# EAGLE schematic Esquemático v92 (EAGLE 9.7.0)
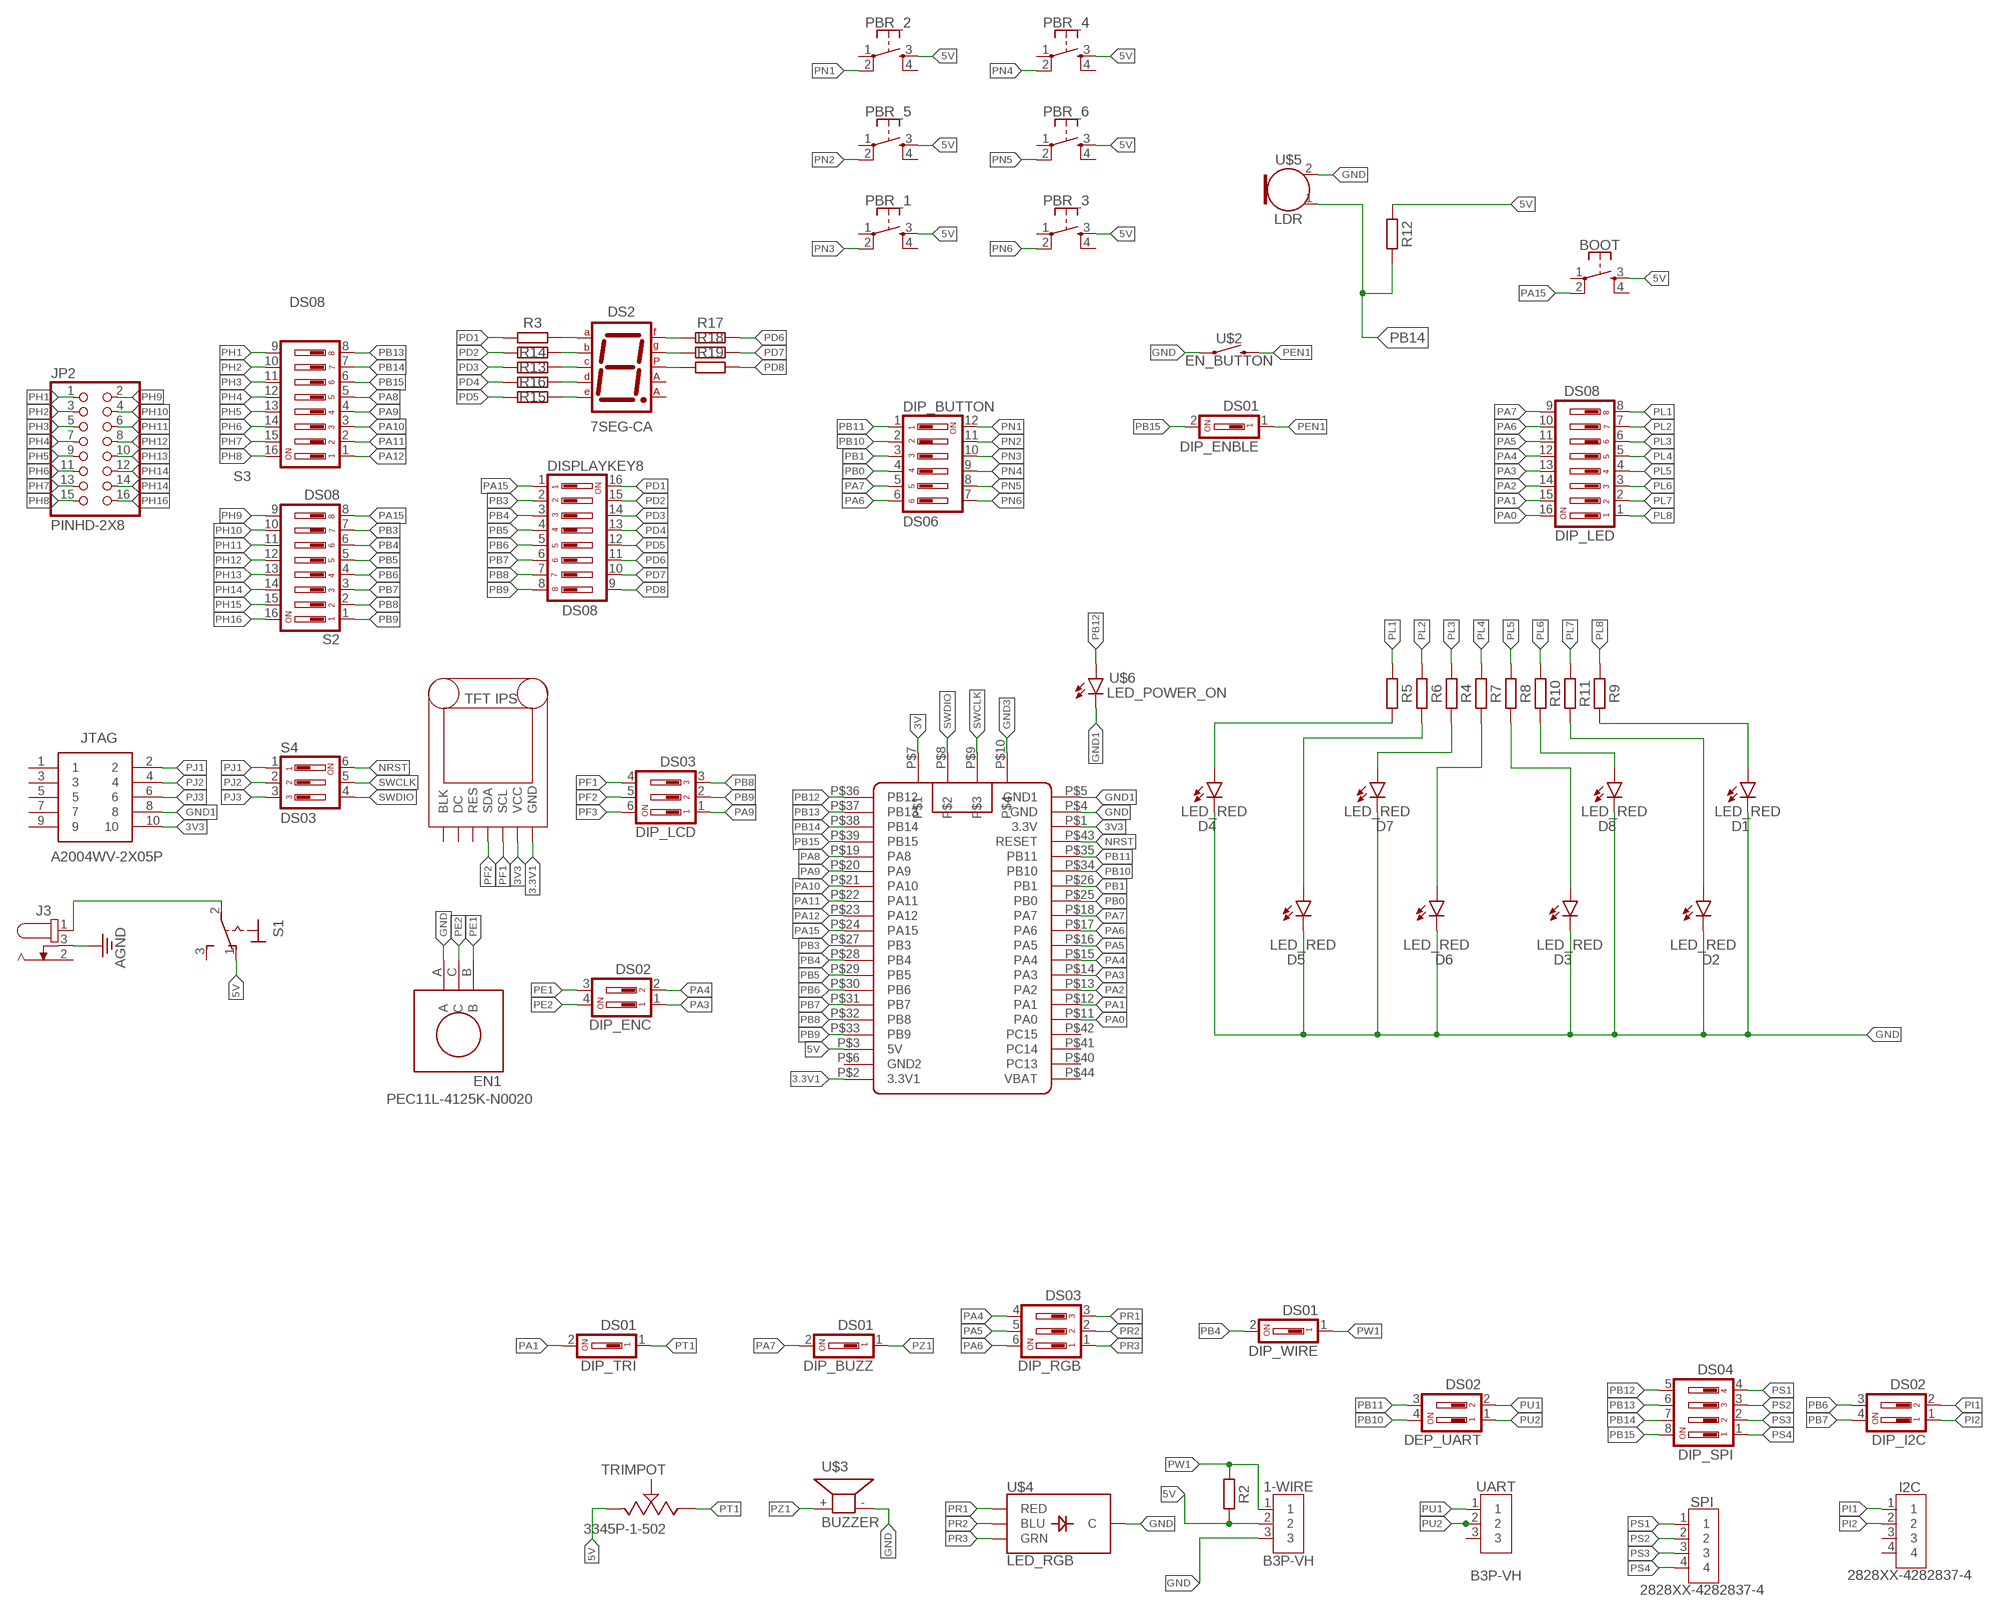
[diagram p0: schematic, sheet 1]

## Parts
1-WIRE  B3P-VH  [B3P-VH_396_3N]
BOOT  PUSHBUTTON_RED  [TACTILE_SWITCH_PTH_6.0MM]
D1  LED_RED  LED_RADIAL_RED  [LEDRD254W60D565H860B]
D2  LED_RED  LED_RADIAL_RED  [LEDRD254W60D565H860B]
D3  LED_RED  LED_RADIAL_RED  [LEDRD254W60D565H860B]
D4  LED_RED  LED_RADIAL_RED  [LEDRD254W60D565H860B]
D5  LED_RED  LED_RADIAL_RED  [LEDRD254W60D565H860B]
D6  LED_RED  LED_RADIAL_RED  [LEDRD254W60D565H860B]
D7  LED_RED  LED_RADIAL_RED  [LEDRD254W60D565H860B]
D8  LED_RED  LED_RADIAL_RED  [LEDRD254W60D565H860B]
DEP_UART  DS02  [DS-02]
DIP_BUTTON  DS06  [DS-06]
DIP_BUZZ  DS01  [DS-01]
DIP_ENBLE  DS01  [DS-01]
DIP_ENC  DS02  [DS-02]
DIP_I2C  DS02  [DS-02]
DIP_LCD  DS03  [DS-03]
DIP_LED  DS08  [DS-08]
DIP_RGB  DS03  [DS-03]
DIP_SPI  DS04  [DS-04]
DIP_TRI  DS01  [DS-01]
DIP_WIRE  DS01  [DS-01]
DISPLAYKEY8  DS08  [DS-08]
DS2  7SEG-CA  [7SEG-13]
DSPLY1  TFT_IPS_1.3  [TFT8]
EN1  PEC11L-4125K-N0020  [PEC11L-4125K-N0020]
I2C  2828XX-4282837-4  [TERMBLK_508-4N]
J3  694106402002  [694106402002]
JP2  PINHD-2X8  [2X08]
JTAG  A2004WV-2X05P  [SHDR10W50P200X200_2X5_1200X500]
PBR_1  PUSHBUTTON_RED  [TACTILE_SWITCH_PTH_6.0MM]
PBR_2  PUSHBUTTON_RED  [TACTILE_SWITCH_PTH_6.0MM]
PBR_3  PUSHBUTTON_RED  [TACTILE_SWITCH_PTH_6.0MM]
PBR_4  PUSHBUTTON_RED  [TACTILE_SWITCH_PTH_6.0MM]
PBR_5  PUSHBUTTON_RED  [TACTILE_SWITCH_PTH_6.0MM]
PBR_6  PUSHBUTTON_RED  [TACTILE_SWITCH_PTH_6.0MM]
R2  R_AXIAL-7.2MM-PITCH  [RESAD724W46L381D178B]
R3  R_AXIAL-7.2MM-PITCH  [RESAD724W46L381D178B]
R4  R_AXIAL-7.2MM-PITCH  [RESAD724W46L381D178B]
R5  R_AXIAL-7.2MM-PITCH  [RESAD724W46L381D178B]
R6  R_AXIAL-7.2MM-PITCH  [RESAD724W46L381D178B]
R7  R_AXIAL-7.2MM-PITCH  [RESAD724W46L381D178B]
R8  R_AXIAL-7.2MM-PITCH  [RESAD724W46L381D178B]
R9  R_AXIAL-7.2MM-PITCH  [RESAD724W46L381D178B]
R10  R_AXIAL-7.2MM-PITCH  [RESAD724W46L381D178B]
R11  R_AXIAL-7.2MM-PITCH  [RESAD724W46L381D178B]
R12  R_AXIAL-7.2MM-PITCH  [RESAD724W46L381D178B]
R13  R_AXIAL-7.2MM-PITCH  [RESAD724W46L381D178B]
R14  R_AXIAL-7.2MM-PITCH  [RESAD724W46L381D178B]
R15  R_AXIAL-7.2MM-PITCH  [RESAD724W46L381D178B]
R16  R_AXIAL-7.2MM-PITCH  [RESAD724W46L381D178B]
R17  R_AXIAL-7.2MM-PITCH  [RESAD724W46L381D178B]
R18  R_AXIAL-7.2MM-PITCH  [RESAD724W46L381D178B]
R19  R_AXIAL-7.2MM-PITCH  [RESAD724W46L381D178B]
S1  320-916  [320-916]
S2  DS08  [DS-08]
S3  DS08  [DS-08]
S4  DS03  [DS-03]
SPI  2828XX-4282837-4  [TERMBLK_508-4N]
TRIMPOT  3345P-1-502  [3345P-1-502]
U$2  EN_BUTTON  [EN_BUTTON]
U$3  BUZZER  [BUZZER]
U$4  LED_RGB  [LED-RGB-THRU]
U$5  LDR  [LDR]
U$6  LED_POWER_ON  [LED_POWER_ON]
U$8  BLUE_PILL_3D  [BLUE_PILL_3D]
UART  B3P-VH  [B3P-VH_396_3N]

## Nets
3.3V1: DSPLY1.GND U$8.P$2(3.3V1)
3V: U$8.P$7
3V3: DSPLY1.VCC JTAG.10 U$8.P$1(3.3V)
5V: 1-WIRE.2 BOOT.3 D6.1(A) PBR_1.3 PBR_2.3 PBR_3.3 PBR_4.3 PBR_5.3 PBR_6.3 R2.2 R7.2 R12.1 S1.1(O) TRIMPOT.1 U$8.P$3(5V)
AGND: J3.3
GND: 1-WIRE.3 D1.2(C) D2.2(C) D3.2(C) D4.2(C) D5.2(C) D6.2(C) D7.2(C) D8.2(C) EN1.A U$2.1 U$3.- U$4.2(C) U$5.2(OUT) U$8.P$4(GND)
GND1: JTAG.8 U$6.P$2(C) U$8.P$5(GND1)
GND3: U$8.P$10
N$1: DS2.7(A) R3.2
N$2: DS2.6(B) R13.1
N$3: DS2.4(C) R14.2
N$4: J3.1 S1.2(P)
N$5: DS2.2(D) R15.1
N$6: DS2.1(E) R16.2
N$7: DS2.9(F) R17.1
N$8: DS2.10(G) R18.1
N$9: DS2.5(DP) R19.1
N$11: D4.1(A) R5.2
N$12: D5.1(A) R6.2
N$13: D7.1(A) R4.2
N$14: D3.1(A) R8.2
N$15: D8.1(A) R10.2
N$16: D2.1(A) R11.2
N$17: D1.1(A) R9.2
NRST: S4.6 U$8.P$43(RESET)
PA0: DIP_LED.16 U$8.P$11(PA0)
PA1: DIP_LED.15 DIP_TRI.2 U$8.P$12(PA1)
PA2: DIP_LED.14 U$8.P$13(PA2)
PA3: DIP_ENC.1 DIP_LED.13 U$8.P$14(PA3)
PA4: DIP_ENC.2 DIP_LED.12 DIP_RGB.4 U$8.P$15(PA4)
PA5: DIP_LED.11 DIP_RGB.5 U$8.P$16(PA5)
PA6: DIP_BUTTON.6 DIP_LED.10 DIP_RGB.6 U$8.P$17(PA6)
PA7: DIP_BUTTON.5 DIP_BUZZ.2 DIP_LED.9 U$8.P$18(PA7)
PA8: S3.5 U$8.P$19(PA8)
PA9: DIP_LCD.1 S3.4 U$8.P$20(PA9)
PA10: S3.3 U$8.P$21(PA10)
PA11: S3.2 U$8.P$22(PA11)
PA12: S3.1 U$8.P$23(PA12)
PA15: BOOT.2 DISPLAYKEY8.1 S2.8 U$8.P$24(PA15)
PB0: DIP_BUTTON.4 U$8.P$25(PB0)
PB1: DIP_BUTTON.3 U$8.P$26(PB1)
PB3: DISPLAYKEY8.2 S2.7 U$8.P$27(PB3)
PB4: DIP_WIRE.2 DISPLAYKEY8.3 S2.6 U$8.P$28(PB4)
PB5: DISPLAYKEY8.4 S2.5 U$8.P$29(PB5)
PB6: DIP_I2C.3 DISPLAYKEY8.5 S2.4 U$8.P$30(PB6)
PB7: DIP_I2C.4 DISPLAYKEY8.6 S2.3 U$8.P$31(PB7)
PB8: DIP_LCD.3 DISPLAYKEY8.7 S2.2 U$8.P$32(PB8)
PB9: DIP_LCD.2 DISPLAYKEY8.8 S2.1 U$8.P$33(PB9)
PB10: DEP_UART.4 DIP_BUTTON.2 U$8.P$34(PB10)
PB11: DEP_UART.3 DIP_BUTTON.1 U$8.P$35(PB11)
PB12: DIP_SPI.5 U$6.P$1(A) U$8.P$36(PB12)
PB13: DIP_SPI.6 S3.8 U$8.P$37(PB13)
PB14: DIP_SPI.7 R12.2 S3.7 U$5.1(GND) U$8.P$38(PB14)
PB15: DIP_ENBLE.2 DIP_SPI.8 S3.6 U$8.P$39(PB15)
PD1: DISPLAYKEY8.16 R3.1
PD2: DISPLAYKEY8.15 R13.2
PD3: DISPLAYKEY8.14 R14.1
PD4: DISPLAYKEY8.13 R15.2
PD5: DISPLAYKEY8.12 R16.1
PD6: DISPLAYKEY8.11 R17.2
PD7: DISPLAYKEY8.10 R18.2
PD8: DISPLAYKEY8.9 R19.2
PE1: DIP_ENC.3 EN1.B
PE2: DIP_ENC.4 EN1.C
PEN1: DIP_ENBLE.1 U$2.2
PF1: DIP_LCD.4 DSPLY1.SCL
PF2: DIP_LCD.5 DSPLY1.SDA
PF3: DIP_LCD.6
PH1: JP2.1 S3.9
PH2: JP2.3 S3.10
PH3: JP2.5 S3.11
PH4: JP2.7 S3.12
PH5: JP2.9 S3.13
PH6: JP2.11 S3.14
PH7: JP2.13 S3.15
PH8: JP2.15 S3.16
PH9: JP2.2 S2.9
PH10: JP2.4 S2.10
PH11: JP2.6 S2.11
PH12: JP2.8 S2.12
PH13: JP2.10 S2.13
PH14: JP2.12 JP2.14 S2.14
PH15: S2.15
PH16: JP2.16 S2.16
PI1: DIP_I2C.2
PI2: DIP_I2C.1
PJ1: JTAG.2 S4.1
PJ2: JTAG.4 S4.2
PJ3: JTAG.6 S4.3
PL1: DIP_LED.8 R5.1
PL2: DIP_LED.7 R6.1
PL3: DIP_LED.6 R4.1
PL4: DIP_LED.5 R7.1
PL5: DIP_LED.4 R8.1
PL6: DIP_LED.3 R10.1
PL7: DIP_LED.2 R11.1
PL8: DIP_LED.1 R9.1
PN1: DIP_BUTTON.12 PBR_2.2
PN2: DIP_BUTTON.11 PBR_5.2
PN3: DIP_BUTTON.10 PBR_1.2
PN4: DIP_BUTTON.9 PBR_4.2
PN5: DIP_BUTTON.8 PBR_6.2
PN6: DIP_BUTTON.7 PBR_3.2
PR1: DIP_RGB.3 U$4.4(RED)
PR2: DIP_RGB.2 U$4.1(BLU)
PR3: DIP_RGB.1 U$4.3(GRN)
PS1: DIP_SPI.4 SPI.1
PS2: DIP_SPI.3 SPI.2
PS3: DIP_SPI.2 SPI.3
PS4: DIP_SPI.1 SPI.4
PT1: DIP_TRI.1 TRIMPOT.3
PU1: DEP_UART.2 UART.1
PU2: DEP_UART.1 UART.2
PW1: 1-WIRE.1 DIP_WIRE.1 R2.1
PZ1: DIP_BUZZ.1 U$3.+
SWCLK: S4.5 U$8.P$9
SWDIO: S4.4 U$8.P$8
Unconnected: BOOT.1 BOOT.4 DS2.3(CA1) DS2.8(CA2) DSPLY1.BLK DSPLY1.DC DSPLY1.RES I2C.1 I2C.2 I2C.3 I2C.4 J3.2 JTAG.1 JTAG.3 JTAG.5 JTAG.7 JTAG.9 PBR_1.1 PBR_1.4 PBR_2.1 PBR_2.4 PBR_3.1 PBR_3.4 PBR_4.1 PBR_4.4 PBR_5.1 PBR_5.4 PBR_6.1 PBR_6.4 S1.3(S) TRIMPOT.2 U$8.P$6(GND2) U$8.P$40(PC13) U$8.P$41(PC14) U$8.P$42(PC15) U$8.P$44(VBAT) UART.3

## Library data of the parts
1-WIRE UART = Connector:B3P-VH: VH Connector Top Entry - POS, 3POS 7.92MM Details see: Datasheet <http://www.jst-mfg.com/product/pdf/eng/eVH.pdf>; CATEGORY: Connector; DESCRIPTION: CONN HEADER VERT 3POS 3.96MM; MANUFACTURER: JST Sales America Inc.; MPN: B3P-VH; OPERATING_TEMPERATURE: -25°C ~ 85°C; PART_STATUS: Active; ROHS_COMPLIANCE: RoHS2 Compliant; SERIES: VH; TYPE: Top Entry
BOOT PBR_1-PBR_6 = 1.3_TFT_IPS:PUSHBUTTON_RED
D1-D8 = Opto-Electronic:LED_RADIAL: LED - Generic; CATEGORY: Opto-Electronic; SUB-CATEGORY: LED
DEP_UART DIP_ENC DIP_I2C = Switch:DS02: DIL/CODE SWITCH; CATEGORY: SWITCH; MPN: MCNDS02; TYPE: SPST
DIP_BUTTON = Switch:DS06: DIL/CODE SWITCH; CATEGORY: SWITCH; MPN: MCNDS-06-V; TYPE: SPST
DIP_BUZZ DIP_ENBLE DIP_TRI DIP_WIRE = Switch:DS01: DIL/CODE SWITCH; CATEGORY: SWITCH; TYPE: SPST
DIP_LCD DIP_RGB S4 = Switch:DS03: DIL/CODE SWITCH; CATEGORY: SWITCH; MPN: MCNDS-03-V; TYPE: SPST
DIP_LED DISPLAYKEY8 S2 S3 = Switch:DS08: DIL/CODE SWITCH; CATEGORY: SWITCH; MPN: MCNDS-08-V; TYPE: SPST
DIP_SPI = Switch:DS04: DIL/CODE SWITCH; CATEGORY: SWITCH; MPN: MCNDS-04-V; TYPE: SPST
DS2 = Opto-Electronic:7SEG-CA: 7-segment DISPLAY single anode, 13 mm; CATEGORY: Opto-Electronic; SUB-CATEGORY: Display; TYPE: 7-Segment
DSPLY1 = 1.3_TFT_IPS:TFT_IPS_1.3
EN1 = Encoders:PEC11L-4125K-N0020: ROTARY ENCODER MECHANICAL 20PPR Manufacturer's datasheet <https://www.bourns.com/docs/Product-Datasheets/PEC11L.pdf>; CREATED_BY: PCBLayout.com; DIGIKEY_PARTNO: PEC11L-4125K-N0020-ND; MANUFACTURER: Bourns Inc.; MPN: PEC11L-4125K-N0020
I2C SPI = Connector:2828XX-4: 4 Position Wire to Board Terminal Block Horizontal with Board Datasheet <https://www.te.com.cn/commerce/DocumentDelivery/DDEController?Action=showdoc&DocId=Catalog+Section%7F1308389_EUROSTYLE_TERMINAL_BLOCKS%7F0607%7Fpdf%7FEnglish%7FENG_CS_1308389_EUROSTYLE_TERMINAL_BLOCKS_0607.pdf%7F2-282837-5>; CATEGORY: Connector; DESCRIPTION: TERM BLK 4P SIDE ENT 5.08mm PCB; MANUFACTURER: TE Connectivity; MPN: 282837-4; OPERATING_TEMPERATURE: 40°C to +105°C; PART_STATUS: Active; ROHS_COMPLIANCE: RoHS Compliant; SERIES: 283737; SUBCATEGORY: Terminal Block; TYPE: Side Wire Entry
J3 = Connector:694106402002: DC POWER JACK - VERTICAL - THT - 2.0 & 2.5Ø - WR-DC Details see: Datasheet <https://katalog.we-online.com/en/em/DC_THT_VERTICAL_6_4_69410X402002>; CATEGORY: Connector; DESCRIPTION: DC POWER JACK - VERTICAL - THT - 2.0 & 2.5Ø - WR-DC; MANUFACTURER: Würth Elektronik; MPN: 694106402002; OPERATING_TEMPERATURE: -40°C to +85°C; PART_STATUS: Active; ROHS_COMPLIANCE: RoHS Compliant; SERIES: WR-DC; SUBCATEGORY: Power Connector; TYPE: Vertical
JP2 = Connector:PINHD-2X8: PIN HEADER; CATEGORY: CONNECTOR; SUB-CATEGORY: PIN-HEADER
JTAG = A2004WV-2X05P:A2004WV-2X05P: A2004WV-2X05P JOINT TECH Socket; wire-board; male; 2mm; PIN: 10; THT; 250V; 3A; -2585C Source: Datasheet <http://ftp.hr-connector.com.tw/web/產品圖面/A2004WV-2XNPNXXXXXXXX---11A4.pdf>; DESCRIPTION: A2004WV-2X05P JOINT TECH Socket; wire-board; male; 2mm; PIN: 10; THT; 250V; 3A; -2585C; HEIGHT: 6.75mm; MANUFACTURER_NAME: Joint Tech Electronic; MANUFACTURER_PART_NUMBER: A2004WV-2X05P
R2-R19 = Resistor:R: Resistor Fixed - Generic; CATEGORY: Resistor; SUB-CATEGORY: Fixed
S1 = switch:320-916: TOGGLE SWITCH distributor RS Components
TRIMPOT = Potentiometer_Trimmers:3345P-1-502: TRIMMER 5K OHM 1W PC PIN TOP ADJ Manufacturer's datasheet <https://www.bourns.com/docs/Product-Datasheets/3345.pdf>; CREATED_BY: PCBLayout.com; DIGIKEY_PN: 3345P-502-ND; MANUFACTURER: Bourns Inc.; MPN: 3345P-1-502
U$2 = 1.3_TFT_IPS:EN_BUTTON
U$3 = 1.3_TFT_IPS:BUZZER
U$4 = 1.3_TFT_IPS:LED_RGB
U$5 = 1.3_TFT_IPS:LDR
U$6 = 1.3_TFT_IPS:LED_POWER_ON
U$8 = 1.3_TFT_IPS:BLUE_PILL_3D